# EAGLE design ATTiny85_Breadboard (EAGLE 9.6.2)
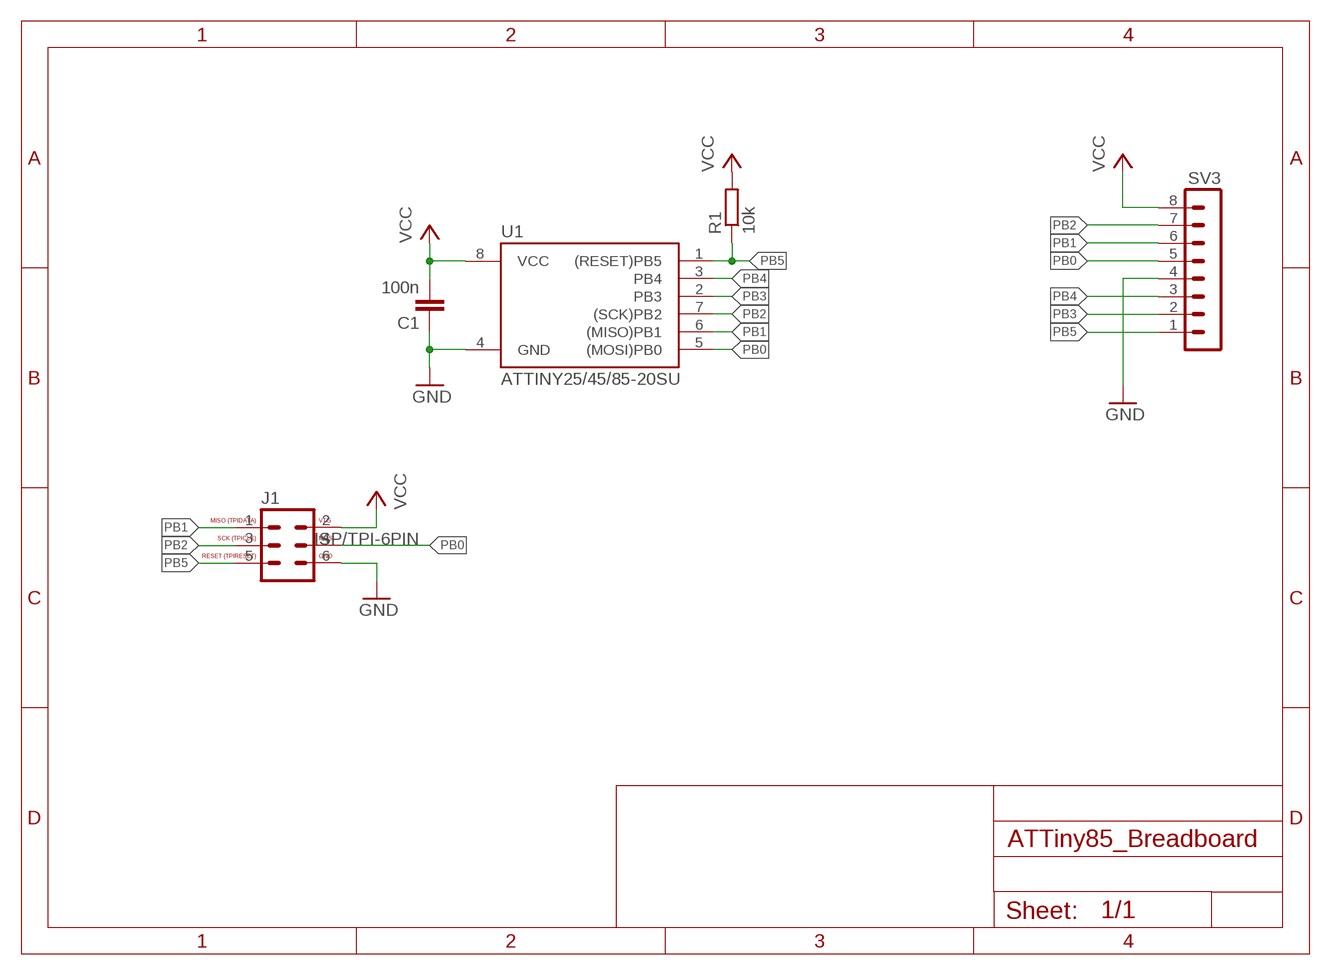
[diagram p0: schematic, sheet 1]

## Parts
C1  100n  C-EUC0402  [C0402]
J1  ISP/TPI-6PIN  [ML6]
R1  10k  R-EU_R0402  [R0402]
SV3  MA08-1  [MA08-1]
U1  ATTINY25/45/85-20SU  [SOIC8_200]

## Nets
GND: C1.1 J1.6 SV3.4 U1.4(GND)
PB0: J1.4 SV3.5 U1.5((MOSI)PB0)
PB1: J1.1 SV3.6 U1.6((MISO)PB1)
PB2: J1.3 SV3.7 U1.7((SCK)PB2)
PB3: SV3.2 U1.2(PB3)
PB4: SV3.3 U1.3(PB4)
PB5: J1.5 R1.1 SV3.1 U1.1((RESET)PB5)
VCC: C1.2 J1.2 R1.2 SV3.8 U1.8(VCC)

## Library data of the parts
C1 = rcl:C-EU: CAPACITOR, European symbol; SPICEPREFIX: C
J1 = Eigene-Rietig:ISP/TPI-6PIN: 6 poliger ISP/TPI-Anschluss für AVRs
R1 = rcl:R-EU_: RESISTOR, European symbol; SPICEPREFIX: R
SV3 = con-lstb:MA08-1: PIN HEADER; OC_FARNELL: unknown; OC_NEWARK: unknown
U1 = Eigene-Rietig:ATTINY25/45/85

## Board
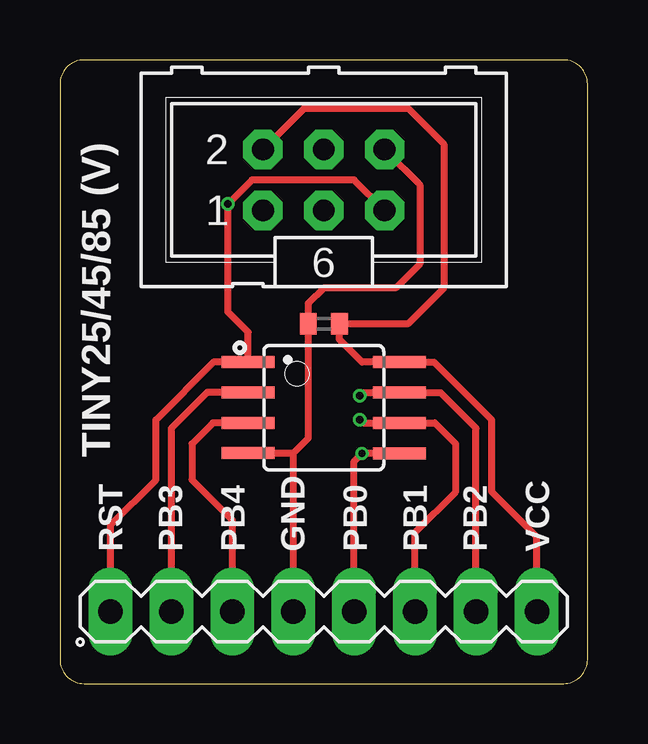
[diagram p1: board, top side]
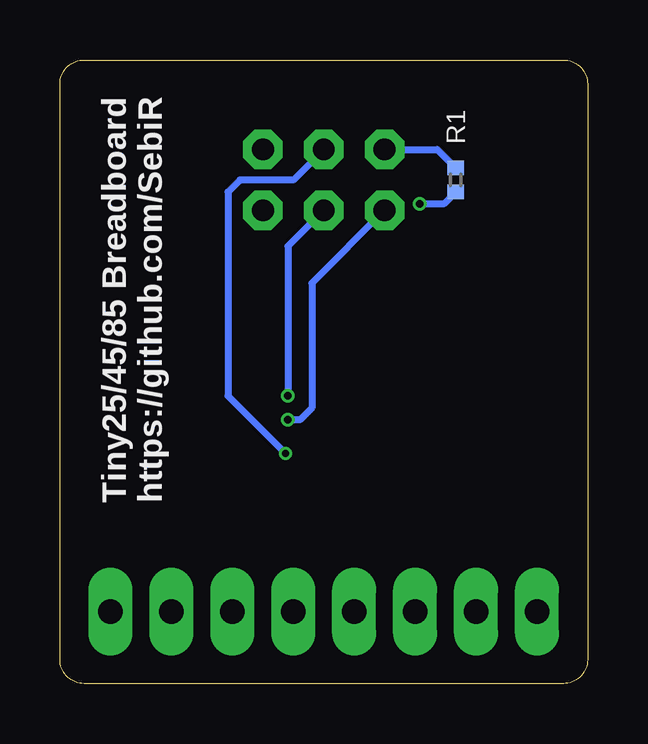
[diagram p2: board, bottom side, seen from below]

Size 22 x 26 mm. Coordinates in mm from the lower left corner, seen from the top.
Outline: 21,26 1,26 arc90 0,25 0,1 arc90 1,0 21,0 arc90 22,1 22,25 arc90 21,26
Copper layers (1*16): Top 0.035mm / dielectric 1.6mm / Bottom 0.035mm
Design rules "jlcpcb-2layers": minimum track width 0.2mm, minimum drill 0.3mm, track to track 5mil, track to pad 5mil, pad to pad 5mil, via to via 5mil, smd to smd 5mil, copper to edge 0.2mm, drill to drill 6mil, minimum pad ring 10mil, minimum via ring 0.125mm, stop-mask expansion 4mil, vias tented up to drill 0.5mm, thermal gap 10mil

### Footprints (pad centres in the part's own frame; a part is rotated, then mirrored left to right if it is on the bottom)
C0402 = smd 0.7 x 0.9: 1 -0.65,0; 2 0.65,0
ML6 = drill 0.914 octagon: 1 -2.54,-1.27; 2 -2.54,1.27; 3 0,-1.27; 4 0,1.27; 5 2.54,-1.27; 6 2.54,1.27
R0402 = smd 0.6 x 0.7: 1 -0.5,0; 2 0.5,0
MA08-1 = drill 1.016 long: 1 -8.89,0; 2 -6.35,0; 3 -3.81,0; 4 -1.27,0; 5 1.27,0; 6 3.81,0; 7 6.35,0; 8 8.89,0
SOIC8_200 = smd 0.5 x 2.2: 1 -1.905,-3.154; 2 -0.645,-3.154; 3 0.625,-3.154; 4 1.895,-3.154; 5 1.905,3.154; 6 0.635,3.154; 7 -0.635,3.154; 8 -1.905,3.154

### Placement (x,y rotation side)
C1  11,15 0 top
J1  11,21 0 top
R1  5.5,21 90 bottom
SV3  11,3 0 top
U1  11,11.5 270 top

### Tracks (layer width: path | path; a pad name or v marks a point on that pad's centre or on a via)
GND
  Top 0.3: SV3.4 9.73,9.61 | U1.4 9.73,9.61 | J1.6 15,20.81 15,17.5 14,16.5 11,16.5 10.35,15.85 C1.1 10.35,10.22 9.73,9.61
PB0  (via drill 0.3)
  Top 0.3: SV3.5 12.27,9.27 v12.6,9.6 U1.5
  Bottom 0.3: J1.4 12.27,21 14.5,21 15,20.5 15,12 v12.6,9.6
PB1  (via drill 0.3)
  Top 0.3: SV3.6 14.81,6.31 16.5,8 16.5,10 15.63,10.87 U1.6 12.63,10.87 v12.5,11
  Bottom 0.3: J1.1 11.5,16.69 11.5,11.5 12,11 v12.5,11
PB2  (via drill 0.3)
  Top 0.3: SV3.7 17.35,10.65 15.87,12.13 U1.7 12.63,12.13 v12.5,12
  Bottom 0.3: J1.3 12.5,18.23 v12.5,12
PB3
  Top 0.3: SV3.2 4.65,10.65 6.14,12.14 U1.2
PB4
  Top 0.3: SV3.3 7.19,6.81 5.5,8.5 5.5,10 6.38,10.88 U1.3
PB5  (via drill 0.3)
  Top 0.3: SV3.1 2.11,6.61 4,8.5 4,11 6.41,13.4 U1.1 7.85,14.65 7,15.5 v7,20 8,21 12.27,21 J1.5
  Bottom 0.3: R1.1 6,20 v7,20
VCC
  Top 0.3: C1.2 11.65,15.15 | SV3.8 19.89,6.11 18,8 18,11 15.6,13.4 U1.8 12.6,13.4 11.65,14.35 C1.2 | J1.2 10.19,24 14.5,24 16,22.5 16,16.5 14.5,15 C1.2
  Bottom 0.3: J1.2 6.27,22.27 R1.2

### Text on the board
tPlace: TINY25/45/85 (V) | RST | PB3 | PB4 | GND | PB0 | PB1 | PB2 | VCC
bPlace: Tiny25/45/85 Breadboard / https://github.com/SebiR